# Altium schematic sheet SP6205.SchDoc
size A4
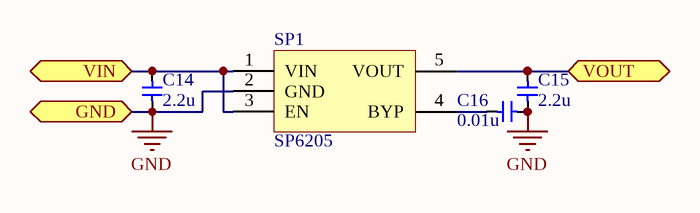
[diagram p0: SP6205.SchDoc]

## Parts
C14  value 2.2u  [CAP_0603]  (hidden comment: Cap_0603)
C15  value 2.2u  [CAP_0603]  (hidden comment: Cap_0603)
C16  value 0.01u  [CAP_0603]  (hidden comment: Cap_0603)
SP1  SP6205  [SOT23-5]

## Ports
GND, VIN, VOUT

## Nets
GND: C14.1 C15.1 C16.1 SP1.2(GND) ; port GND
VIN: C14.2 SP1.1(VIN) SP1.3(EN) ; port VIN
VOUT: C15.2 SP1.5(VOUT) ; port VOUT
NetC16_2: C16.2 SP1.4(BYP)

## Library data of the parts
C14-C16 = Cap_0603: Capacitor
SP1 = SP6205: Power